# EAGLE design vcf (EAGLE 9.6.2)
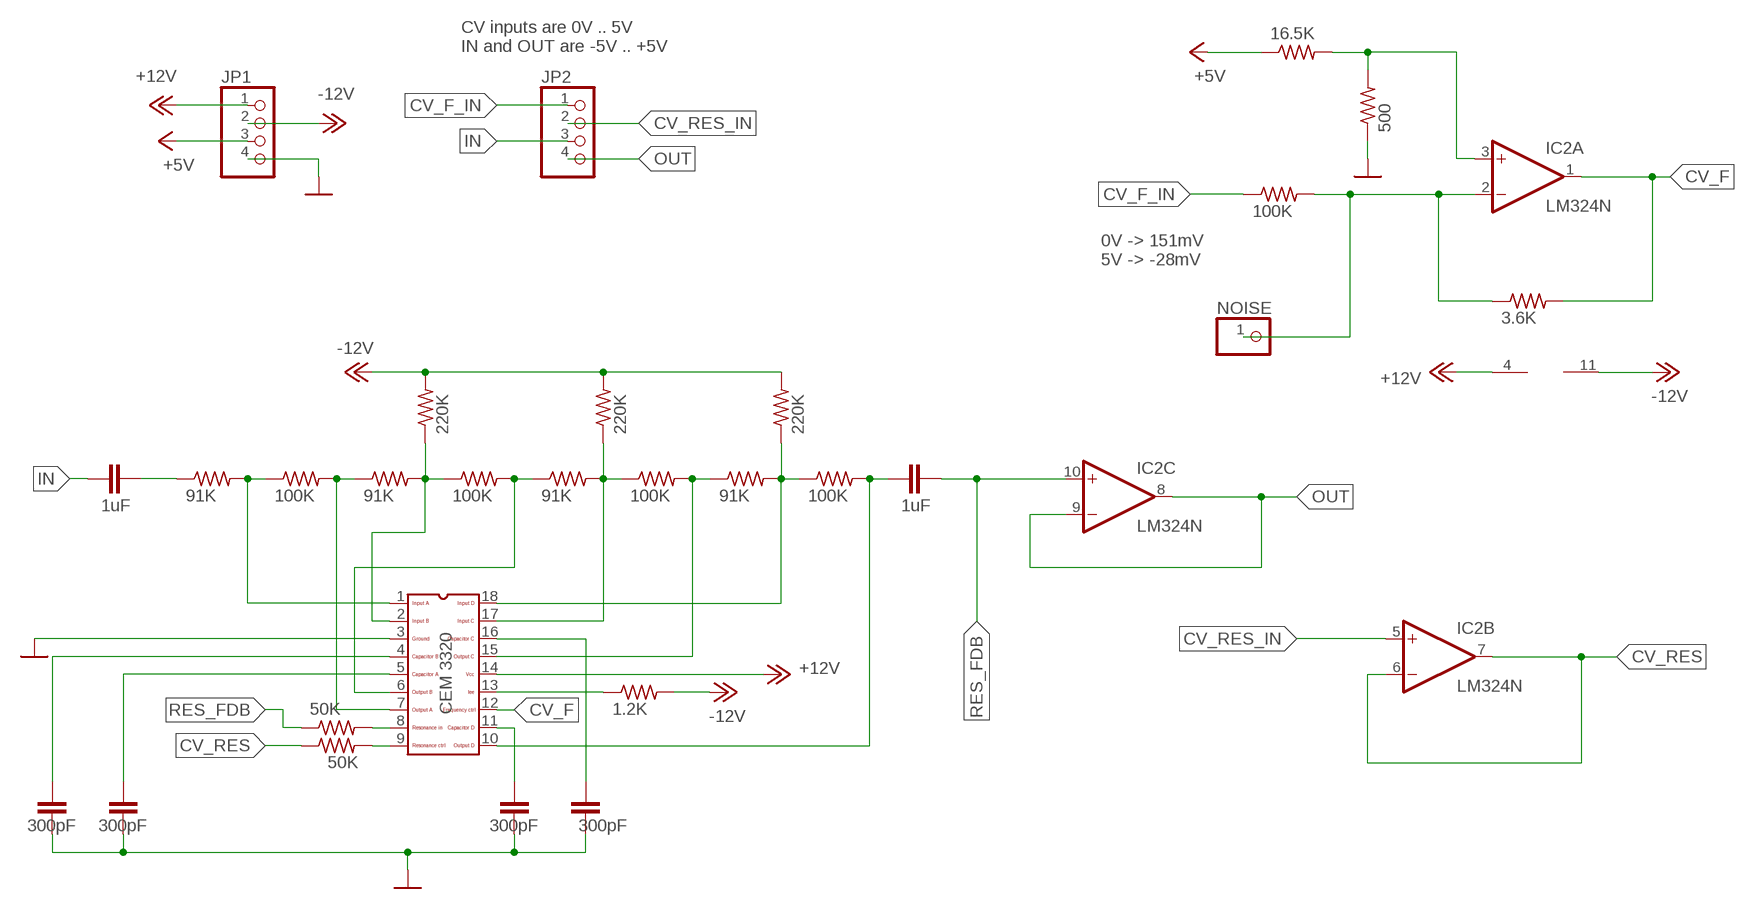
[diagram p0: schematic, sheet 1]

## Parts
C1  300pF  C-EU025-030X050  [C025-030X050]
C2  300pF  C-EU025-030X050  [C025-030X050]
C3  300pF  C-EU025-030X050  [C025-030X050]
C4  300pF  C-EU025-030X050  [C025-030X050]
C5  1uF  C-EU025-030X050  [C025-030X050]
C6  1uF  C-EU025-030X050  [C025-030X050]
IC1  CEM3320  [DIL18]
IC2  LM324N  [DIL14]
JP1  PINHD-1X4  [1X04]
JP2  PINHD-1X4  [1X04]
NOISE  PINHD-1X1  [1X01]
R1  1.2K  R-US_0204/7  [0204/7]
R2  91K  R-US_0204/7  [0204/7]
R3  100K  R-US_0204/7  [0204/7]
R4  91K  R-US_0204/7  [0204/7]
R5  100K  R-US_0204/7  [0204/7]
R6  91K  R-US_0204/7  [0204/7]
R7  100K  R-US_0204/7  [0204/7]
R8  91K  R-US_0204/7  [0204/7]
R9  100K  R-US_0204/7  [0204/7]
R10  220K  R-US_0204/7  [0204/7]
R11  220K  R-US_0204/7  [0204/7]
R12  220K  R-US_0204/7  [0204/7]
R13  16.5K  R-US_0204/7  [0204/7]
R14  500  R-US_0204/7  [0204/7]
R15  100K  R-US_0204/7  [0204/7]
R16  3.6K  R-US_0204/7  [0204/7]
R17  50K  R-US_0204/7  [0204/7]
R18  50K  R-US_0204/7  [0204/7]

## Nets
+5V: JP1.3 R13.1
+12V: IC1.14 IC2.4(P:V+) JP1.1
-12V: IC2.11(P:V-) JP1.2 R1.2 R10.2 R11.2 R12.2
CV_F: IC1.12 IC2.1(A:OUT) R16.2
CV_F_IN: JP2.1 R15.1
CV_RES: IC2.6(B:-IN) IC2.7(B:OUT) R18.1
CV_RES_IN: IC2.5(B:+IN) JP2.2
GND: C1.2 C2.2 C3.2 C4.2 IC1.3 JP1.4 R14.1
IN: C6.1 JP2.3
N$1: IC1.13 R1.1
N$2: C4.1 IC1.4
N$3: C3.1 IC1.5
N$4: C1.1 IC1.11
N$5: C2.1 IC1.16
N$6: IC1.1 R2.2 R3.1
N$7: IC1.7 R3.2 R4.1
N$8: IC1.2 R4.2 R5.1 R11.1
N$9: IC1.6 R5.2 R6.1
N$10: IC1.17 R6.2 R7.1 R10.1
N$11: IC1.15 R7.2 R8.1
N$12: IC1.18 R8.2 R9.1 R12.1
N$13: IC2.3(A:+IN) R13.2 R14.2
N$14: C5.1 IC1.10 R9.2
N$15: IC2.2(A:-IN) NOISE.1 R15.2 R16.1
N$16: C6.2 R2.1
N$17: IC1.8 R17.2
N$18: IC1.9 R18.2
OUT: IC2.8(C:OUT) IC2.9(C:-IN) JP2.4
RES_FDB: C5.2 IC2.10(C:+IN) R17.1
Unconnected: IC2.12(D:+IN) IC2.13(D:-IN) IC2.14(D:OUT)

## Notes on the sheet
- CV inputs are 0V .. 5V
  IN and OUT are -5V .. +5V
- 0V -> 151mV
  5V -> -28mV

## Library data of the parts
C1-C6 = rcl:C-EU: CAPACITOR, European symbol; SPICEPREFIX: C
IC1 = CEM:CEM3320: CEM 3330 VCF
IC2 = linear:LM324: OP AMP
JP1 JP2 = pinhead:PINHD-1X4: PIN HEADER
NOISE = adafruit:PINHD-1X1: Pin header 1x1 for 0.1" spacing With round pins
R1-R18 = adafruit:R-US_: RESISTOR, American symbol

## Board
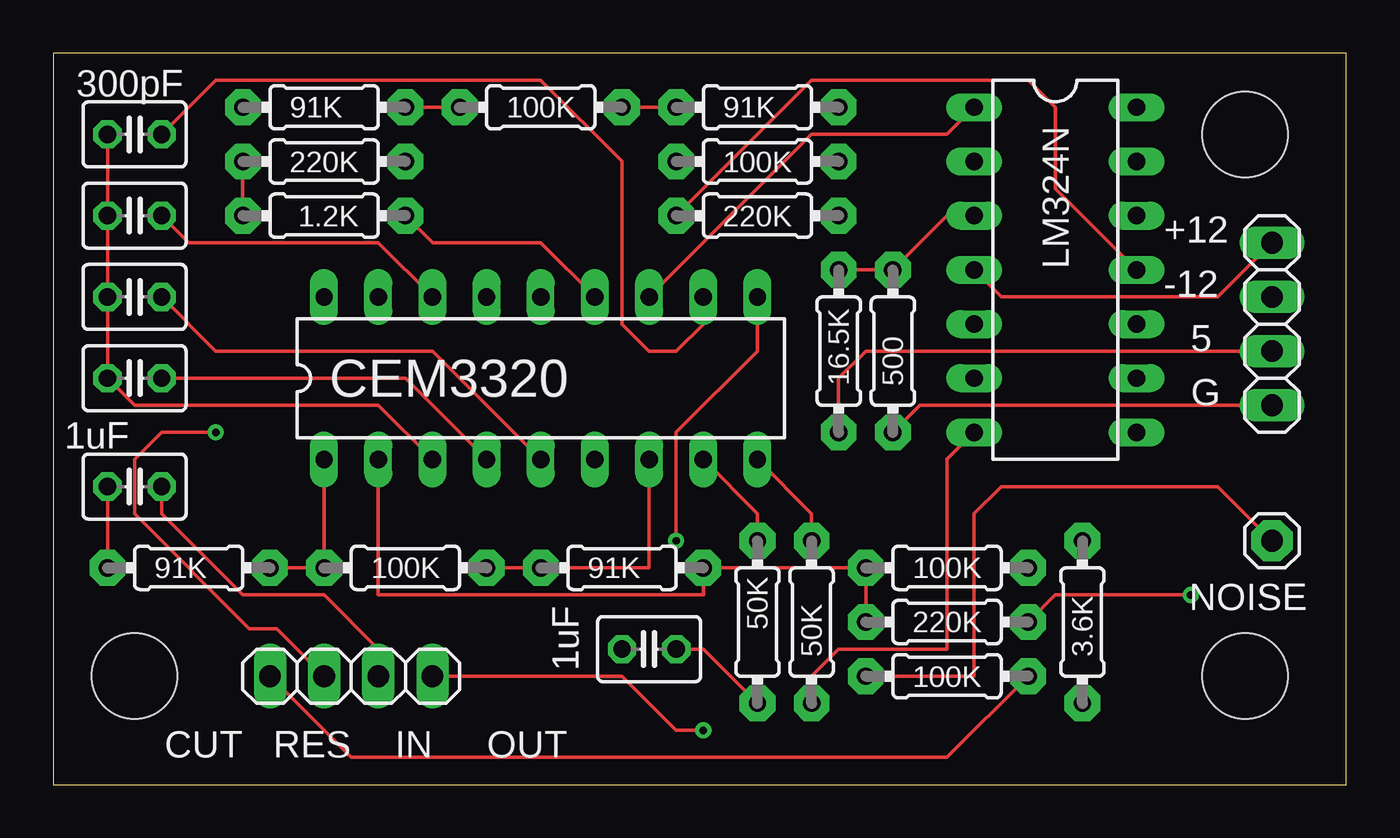
[diagram p1: board, top side]
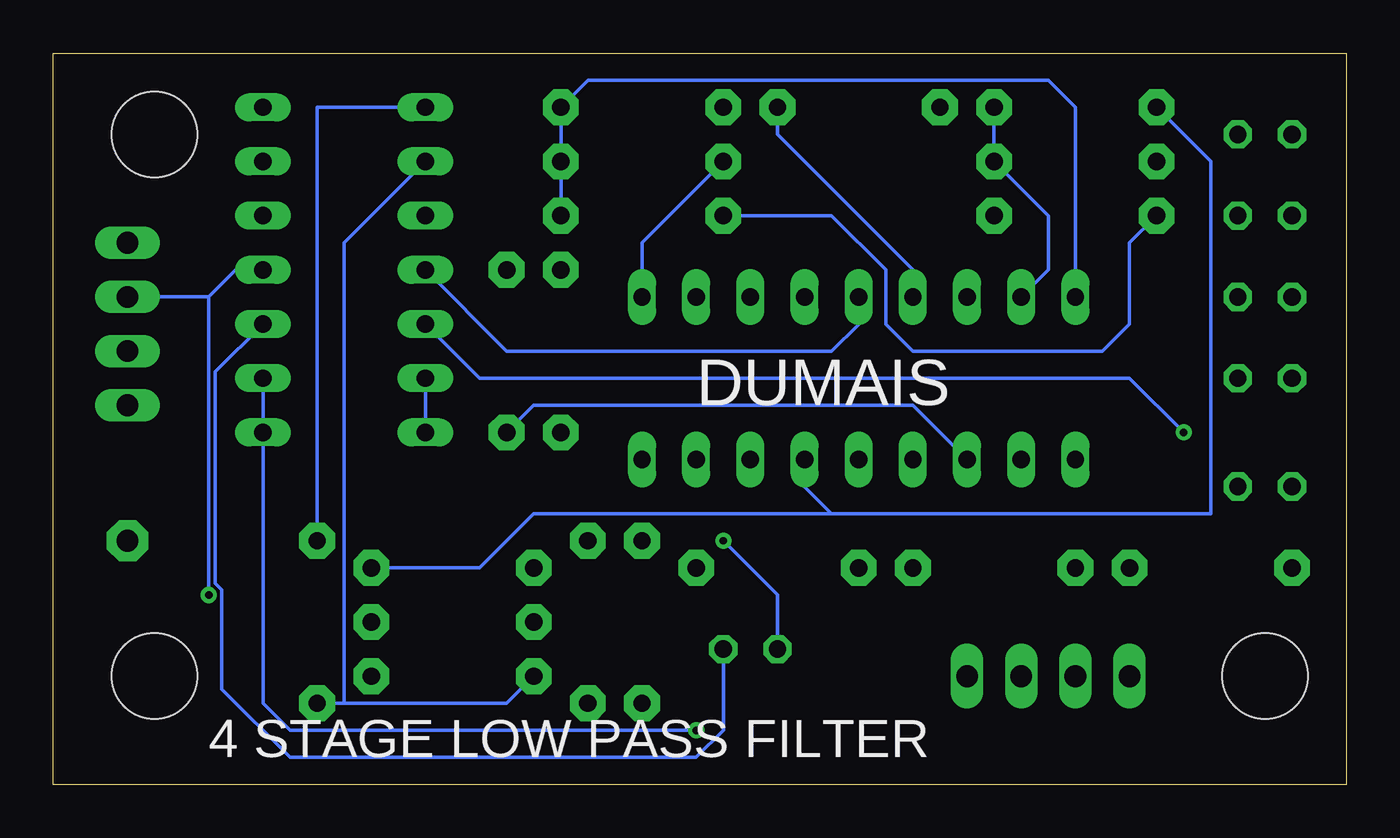
[diagram p2: board, bottom side, seen from below]

Size 60.63 x 34.28 mm. Coordinates in mm from the lower left corner, seen from the top.
Outline: 0,0 60.63,0 60.63,34.28 0,34.28 0,0
Copper layers (1*16): Top 0.035mm / dielectric 1.5mm / Bottom 0.035mm
Design rules "default": minimum track width 6mil, minimum drill 0.35mm, track to track 6mil, track to pad 6mil, pad to pad 6mil, via to via 6mil, smd to smd 6mil, copper to edge 40mil, drill to drill 6mil, minimum pad ring 10mil, minimum via ring 8mil, stop-mask expansion 4mil, vias tented up to drill 0mil, thermal gap 10mil
Holes 4 mm at 3.81,5.08 55.88,5.08 55.88,30.48

### Footprints (pad centres in the part's own frame; a part is rotated, then mirrored left to right if it is on the bottom)
C025-030X050 = drill 0.813 octagon: 1 -1.27,0; 2 1.27,0
DIL18 = drill 0.813 long: 1 -10.16,-3.81; 2 -7.62,-3.81; 3 -5.08,-3.81; 4 -2.54,-3.81; 5 0,-3.81; 6 2.54,-3.81; 7 5.08,-3.81; 8 7.62,-3.81; 9 10.16,-3.81; 10 10.16,3.81; 11 7.62,3.81; 12 5.08,3.81; 13 2.54,3.81; 14 0,3.81; 15 -2.54,3.81; 16 -5.08,3.81; 17 -7.62,3.81; 18 -10.16,3.81
DIL14 = drill 0.813 long: 1 -7.62,-3.81; 2 -5.08,-3.81; 3 -2.54,-3.81; 4 0,-3.81; 5 2.54,-3.81; 6 5.08,-3.81; 7 7.62,-3.81; 8 7.62,3.81; 9 5.08,3.81; 10 2.54,3.81; 11 0,3.81; 12 -2.54,3.81; 13 -5.08,3.81; 14 -7.62,3.81
1X04 = drill 1.016 long: 1 -3.81,0; 2 -1.27,0; 3 1.27,0; 4 3.81,0
1X01 = drill 1.016 pad 1.93 octagon: 1 0,0
0204/7 = drill 0.813 pad 1.676 octagon: 1 -3.81,0; 2 3.81,0

### Placement (x,y rotation side)
C1  3.81,30.48 180 top
C2  3.81,26.67 180 top
C3  3.81,22.86 180 top
C4  3.81,19.05 180 top
C5  27.94,6.35 0 top
C6  3.81,13.97 180 top
IC1  22.86,19.05 0 top
IC2  46.99,24.13 270 top
JP1  57.15,21.59 270 top
JP2  13.97,5.08 0 top
NOISE  57.15,11.43 0 top
R1  12.7,26.67 180 top
R2  6.35,10.16 0 top
R3  16.51,10.16 0 top
R4  26.67,10.16 0 top
R5  41.91,10.16 0 top
R6  12.7,31.75 0 top
R7  22.86,31.75 0 top
R8  33.02,31.75 0 top
R9  33.02,29.21 180 top
R10  12.7,29.21 180 top
R11  41.91,7.62 0 top
R12  33.02,26.67 180 top
R13  36.83,20.32 90 top
R14  39.37,20.32 90 top
R15  41.91,5.08 180 top
R16  48.26,7.62 90 top
R17  33.02,7.62 90 top
R18  35.56,7.62 90 top

### Tracks (layer width: path | path; a pad name or v marks a point on that pad's centre or on a via)
+5V
  Top 0.152: R13.1 36.83,19.05 38.1,20.32 JP1.3
+12V
  Top 0.152: JP1.1 54.61,22.86 44.45,22.86 IC2.4
  Bottom 0.152: IC1.14 22.86,21.59 24.13,20.32 39.37,20.32 IC2.4
-12V  (via drill 0.35)
  Top 0.152: R10.2 R1.2 | R11.2 46.99,8.89 v53.34,8.89 | R12.2 35.56,33.02 45.72,33.02 46.99,31.75 46.99,27.94 IC2.11
  Bottom 0.152: R1.2 10.16,25.4 10.16,21.59 11.43,20.32 20.32,20.32 21.59,21.59 21.59,24.13 24.13,26.67 R12.2 | IC2.11 52.07,24.13 53.34,22.86 | 53.34,22.86 JP1.2 | v53.34,8.89 53.34,22.86
CV_F
  Top 0.152: IC1.12 35.56,30.48 41.91,30.48 IC2.1
  Bottom 0.152: IC2.1 48.26,31.75 R16.2
CV_F_IN
  Top 0.152: R15.1 41.91,1.27 13.97,1.27 JP2.1
CV_RES
  Top 0.152: R18.1 35.56,5.08 36.83,6.35 41.91,6.35 41.91,15.24 IC2.7
  Bottom 0.152: IC2.6 IC2.7
CV_RES_IN  (via drill 0.35)
  Top 0.152: JP2.2 10.46,7.32 9.2,7.32 3.81,12.7 3.81,15.24 5.08,16.51 v7.62,16.51
  Bottom 0.152: v7.62,16.51 10.16,19.05 40.64,19.05 IC2.5
GND
  Top 0.152: IC1.3 15.24,17.78 3.81,17.78 C4.2 C3.2 C2.2 C1.2 | R14.1 40.64,17.78 JP1.4
  Bottom 0.152: R14.1 38.1,17.78 20.32,17.78 IC1.3
IN
  Top 0.152: C6.1 5.08,12.7 8.89,8.89 12.7,8.89 15.24,6.35 JP2.3
N$1
  Top 0.152: R1.1 17.78,25.4 22.86,25.4 IC1.13
N$2
  Top 0.152: C4.1 16.51,19.05 IC1.4
N$3
  Top 0.152: C3.1 7.62,20.32 17.78,20.32 IC1.5
N$4
  Top 0.152: C1.1 7.62,33.02 22.86,33.02 26.67,29.21 26.67,21.59 27.94,20.32 29.21,20.32 30.48,21.59 IC1.11
N$5
  Top 0.152: IC1.16 15.24,25.4 6.35,25.4 C2.1
N$6
  Top 0.152: R2.2 R3.1 IC1.1
N$7
  Top 0.152: R3.2 R4.1 27.94,10.16 IC1.7
N$8
  Top 0.152: IC1.2 15.24,8.89 30.48,8.89 R4.2 R5.1 R11.1
N$9
  Bottom 0.152: R6.1 6.35,29.21 6.35,12.7 24.13,12.7 | IC1.6 25.4,13.97 24.13,12.7 | R5.2 40.64,10.16 38.1,12.7 24.13,12.7
N$10
  Top 0.152: R6.2 R7.1
  Bottom 0.152: R6.2 R10.1 13.97,26.67 13.97,24.13 IC1.17
N$11
  Top 0.152: R7.2 R8.1
  Bottom 0.152: R7.2 26.67,30.48 20.32,24.13 IC1.15
N$12
  Bottom 0.152: IC1.18 12.7,31.75 13.97,33.02 35.56,33.02 R8.2 R9.1 R12.1
N$13
  Top 0.152: R13.2 R14.2 41.91,26.67 IC2.3
N$14  (via drill 0.35)
  Top 0.152: IC1.10 33.02,20.32 29.21,16.51 v29.21,11.43
  Bottom 0.152: R9.2 33.02,25.4 IC1.10 | v29.21,11.43 26.67,8.89 C5.1
N$15
  Top 0.152: R15.2 43.18,5.08 43.18,12.7 44.45,13.97 54.61,13.97 NOISE.1
  Bottom 0.152: R15.2 39.37,3.81 46.99,3.81 | R16.1 46.99,3.81 | IC2.2 46.99,25.4 46.99,3.81
N$16
  Top 0.152: C6.2 R2.1
N$17
  Top 0.152: IC1.8 33.02,12.7 R17.2
N$18
  Top 0.152: IC1.9 35.56,12.7 R18.2
OUT  (via drill 0.35)
  Top 0.152: JP2.4 26.67,5.08 29.21,2.54 v30.48,2.54
  Bottom 0.152: IC2.9 IC2.8 50.8,3.81 49.53,2.54 v30.48,2.54
RES_FDB
  Top 0.152: R17.1 30.48,6.35 C5.2
  Bottom 0.152: IC2.10 53.03,19.36 53.03,9.44 52.73,9.14 52.73,4.47 49.53,1.27 30.48,1.27 29.21,2.54 C5.2

### Text on the board
tPlace: +12 | -12 | 5 | G | CUT | RES | IN | OUT
bPlace: DUMAIS | 4 STAGE LOW PASS FILTER